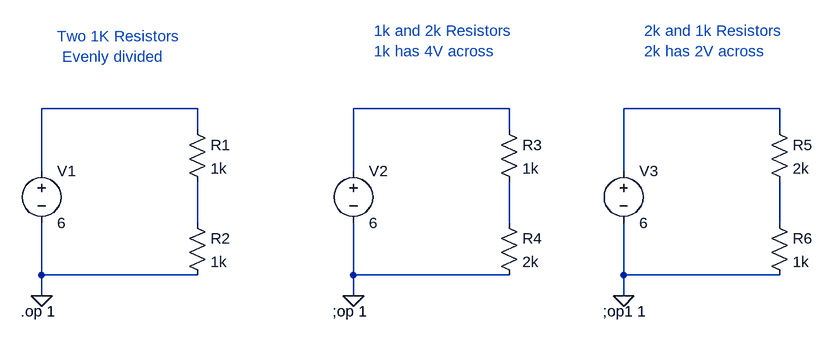
[diagram p0: schematic VoltageDivider01.asc]
VoltageDivider01.asc, the LTspice schematic file:
Version 4
SHEET 1 1384 680
WIRE 432 -1104 192 -1104
WIRE 912 -1104 672 -1104
WIRE 1328 -1104 1088 -1104
WIRE 432 -1072 432 -1104
WIRE 912 -1072 912 -1104
WIRE 1328 -1072 1328 -1104
WIRE 192 -1008 192 -1104
WIRE 672 -1008 672 -1104
WIRE 1088 -1008 1088 -1104
WIRE 432 -928 432 -992
WIRE 912 -928 912 -992
WIRE 1328 -928 1328 -992
WIRE 192 -848 192 -928
WIRE 432 -848 192 -848
WIRE 672 -848 672 -928
WIRE 912 -848 672 -848
WIRE 1088 -848 1088 -928
WIRE 1328 -848 1088 -848
WIRE 192 -816 192 -848
WIRE 672 -816 672 -848
WIRE 1088 -816 1088 -848
FLAG 192 -816 0
FLAG 672 -816 0
FLAG 1088 -816 0
DATAFLAG 432 -960 ""
DATAFLAG 304 -1104 ""
DATAFLAG 912 -960 ""
DATAFLAG 784 -1104 ""
DATAFLAG 1328 -960 ""
DATAFLAG 1200 -1104 ""
SYMBOL res 416 -1088 R0
SYMATTR InstName R1
SYMATTR Value 1k
SYMBOL res 416 -944 R0
SYMATTR InstName R2
SYMATTR Value 1k
SYMBOL voltage 192 -1024 R0
WINDOW 123 0 0 Left 0
WINDOW 39 24 44 Left 2
SYMATTR InstName V1
SYMATTR Value 6
SYMBOL res 896 -1088 R0
SYMATTR InstName R3
SYMATTR Value 1k
SYMBOL res 896 -944 R0
SYMATTR InstName R4
SYMATTR Value 2k
SYMBOL voltage 672 -1024 R0
WINDOW 123 0 0 Left 0
WINDOW 39 24 44 Left 2
SYMATTR InstName V2
SYMATTR Value 6
SYMBOL res 1312 -1088 R0
SYMATTR InstName R5
SYMATTR Value 2k
SYMBOL res 1312 -944 R0
SYMATTR InstName R6
SYMATTR Value 1k
SYMBOL voltage 1088 -1024 R0
WINDOW 123 0 0 Left 0
WINDOW 39 24 44 Left 2
SYMATTR InstName V3
SYMATTR Value 6
TEXT 160 -792 Left 2 !.op 1
TEXT 640 -792 Left 2 !;op 1
TEXT 1056 -792 Left 2 !;op1 1
TEXT 216 -1216 Left 2 ;Two 1K Resistors
TEXT 224 -1184 Left 2 ;Evenly divided
TEXT 704 -1224 Left 2 ;1k and 2k Resistors\n1k has 4V across
TEXT 1120 -1224 Left 2 ;2k and 1k Resistors\n2k has 2V across

The netlist it stands for:
* VoltageDivider01.asc
R1 N001 N004 1k
R2 N004 0 1k
V1 N001 0 6
R3 N002 N005 1k
R4 N005 0 2k
V2 N002 0 6
R5 N003 N006 2k
R6 N006 0 1k
V3 N003 0 6
.op 1
;op 1
;op1 1
* Two 1K Resistors
* Evenly divided
* 1k and 2k Resistors
* 1k has 4V across
* 2k and 1k Resistors
* 2k has 2V across
.backanno
.end